# Altium schematic sheet QCopterFC_USB_Sch.SchDoc
size A4
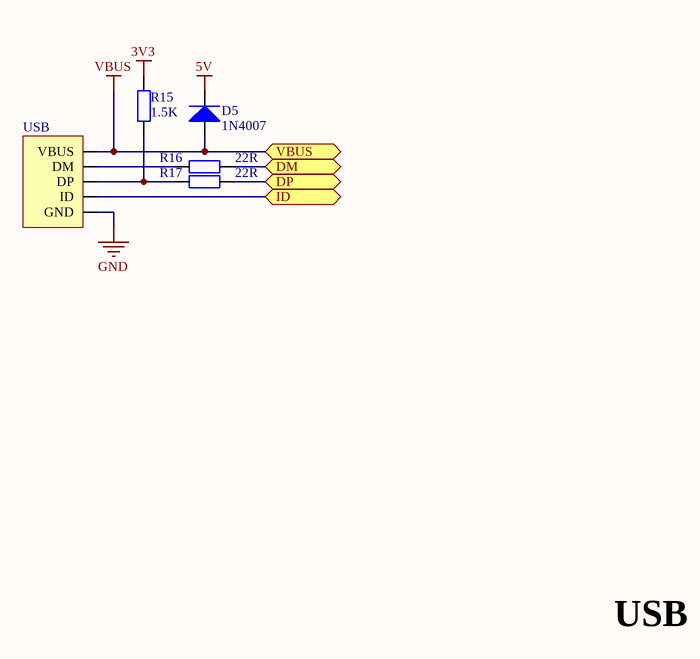
[diagram p0: QCopterFC_USB_Sch.SchDoc]

## Parts
D5  SOD323: 1N4007  [SOD323]  (hidden comment: Diode_SOD323)
R15  value 1.5K  [RES_0603]  (hidden comment: Res_0603)
R16  value 22R  [RES_0603]  (hidden comment: Res_0603)
R17  value 22R  [RES_0603]  (hidden comment: Res_0603)
USB  USB_Micro  [USB_MICRO_B]  (value not drawn)

## Ports
DM, DP, ID, VBUS

## Nets
3V3: R15.2
5V: D5.2(K)
GND: USB.5(GND)
VBUS: D5.1(A) USB.1(VBUS) ; port VBUS
DM: R16.2 ; port DM
DP: R17.2 ; port DP
ID: USB.4(ID) ; port ID
NetR15_1: R15.1 R17.1 USB.3(DP)
NetR16_1: R16.1 USB.2(DM)

## Notes on the sheet
- USB

## Library data of the parts
D5 = Diode_SOD323: Diode
R15-R17 = Res_0603: Resistor
USB = USB_Micro: USB